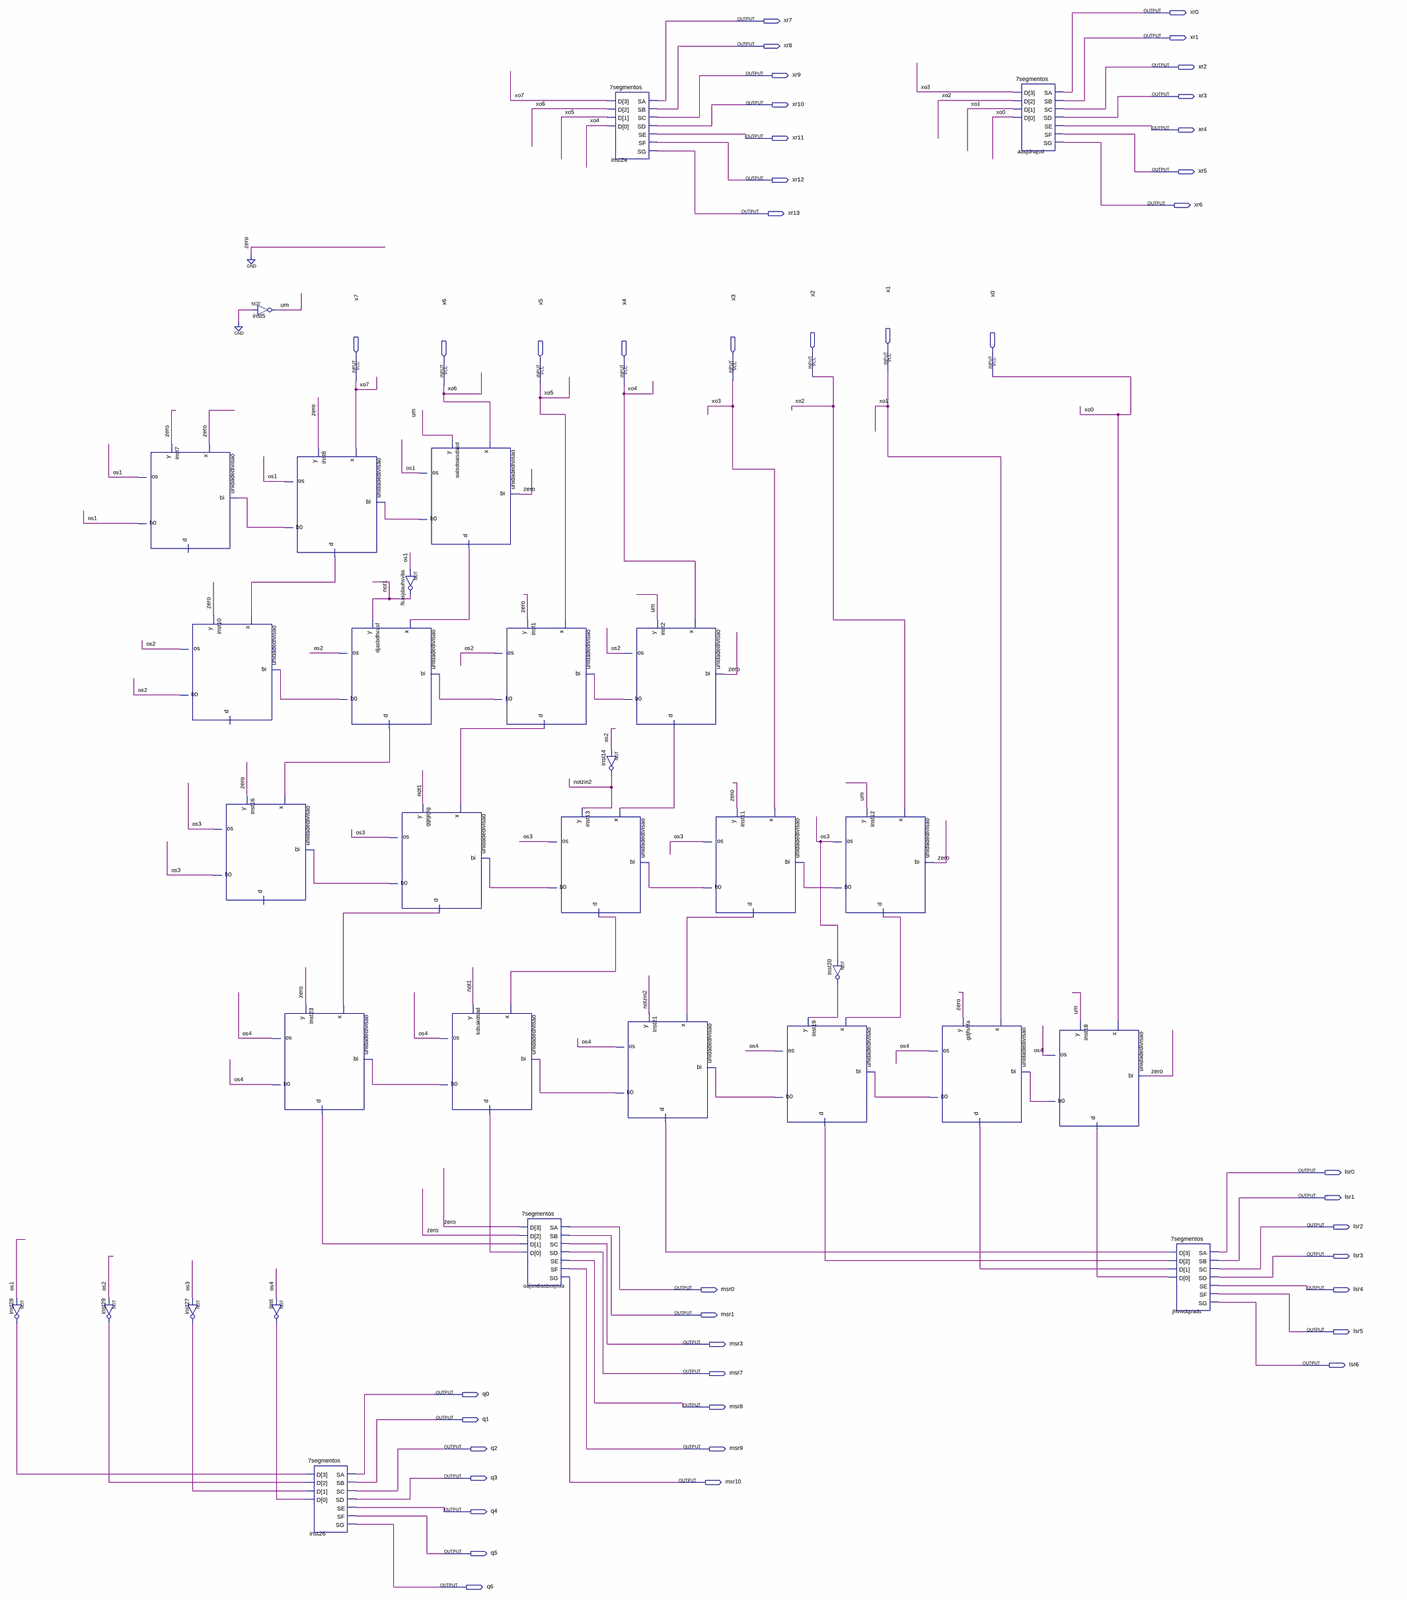
[diagram p0: schematic sheet, whole]
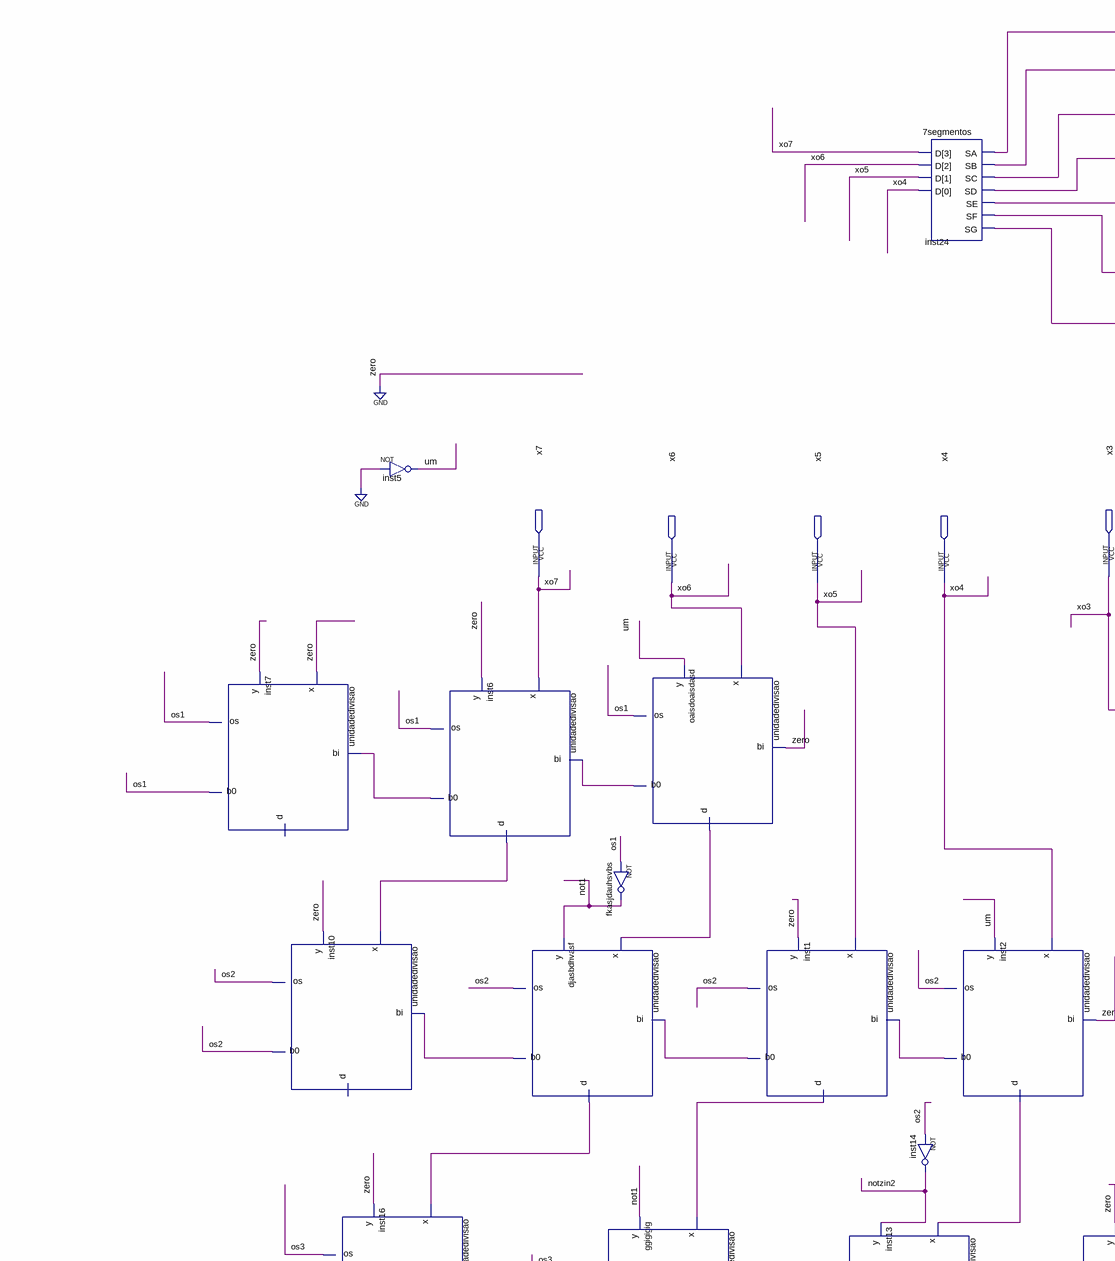
[diagram p1: schematic sheet, upper left part]
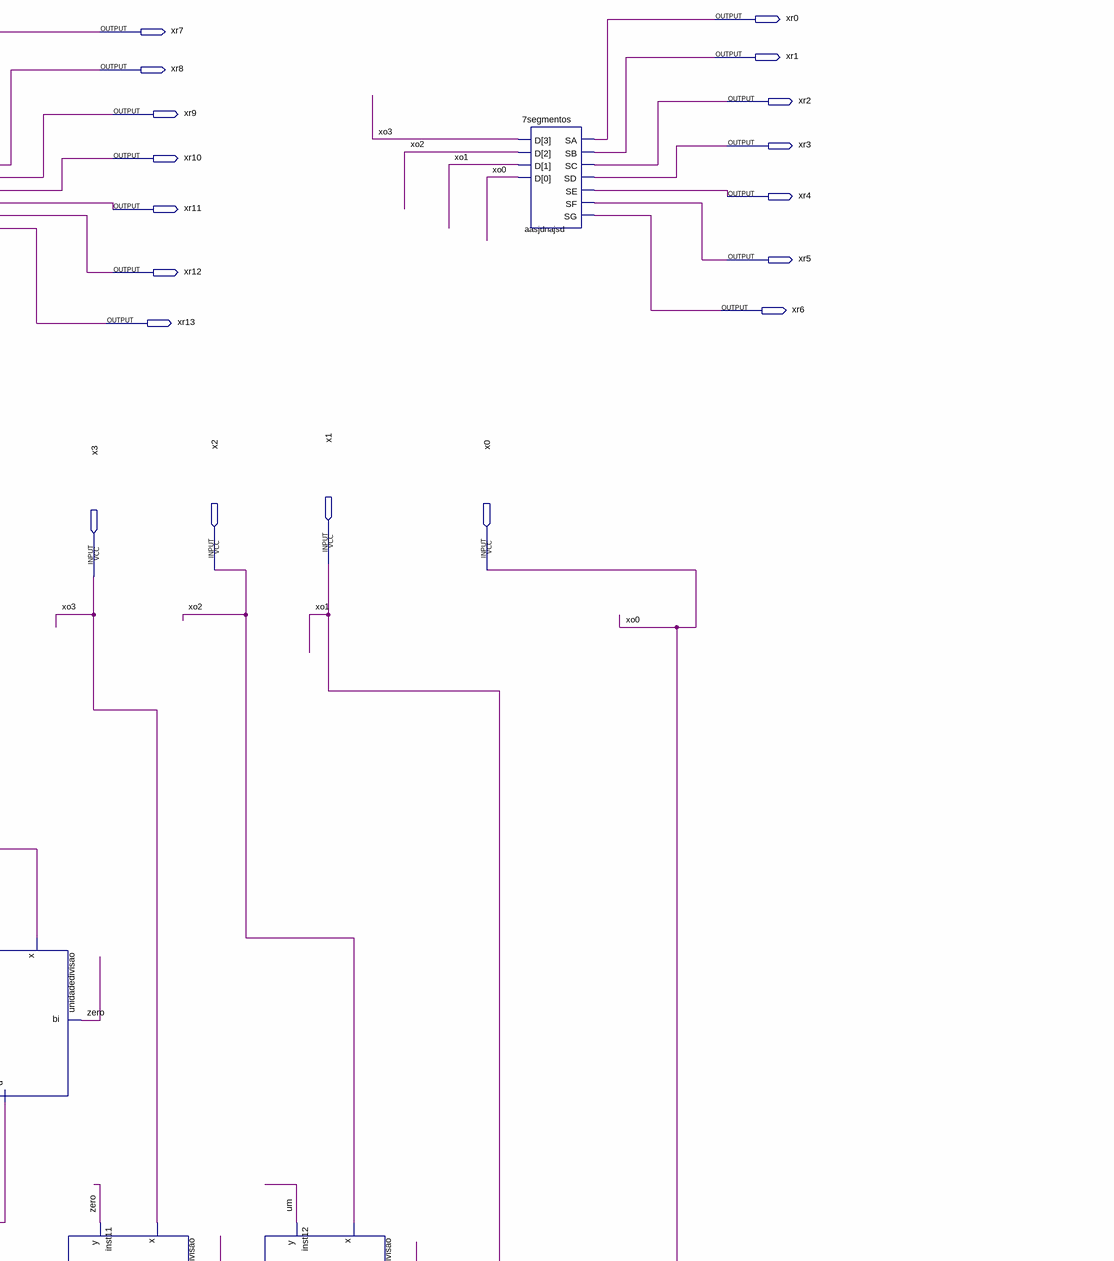
[diagram p2: schematic sheet, upper right part]
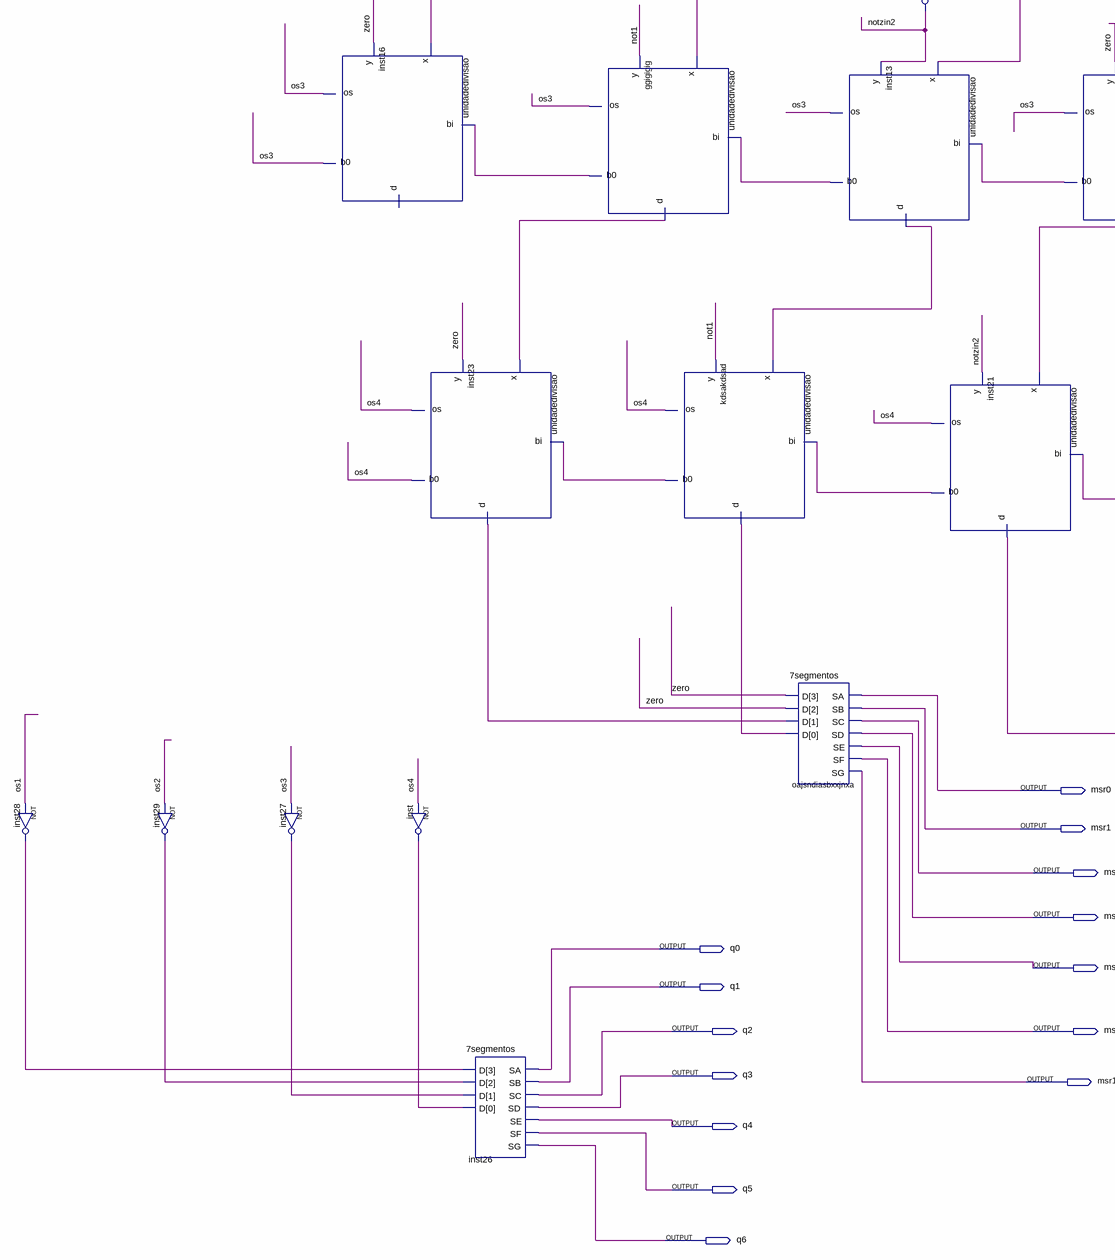
[diagram p3: schematic sheet, lower left part]
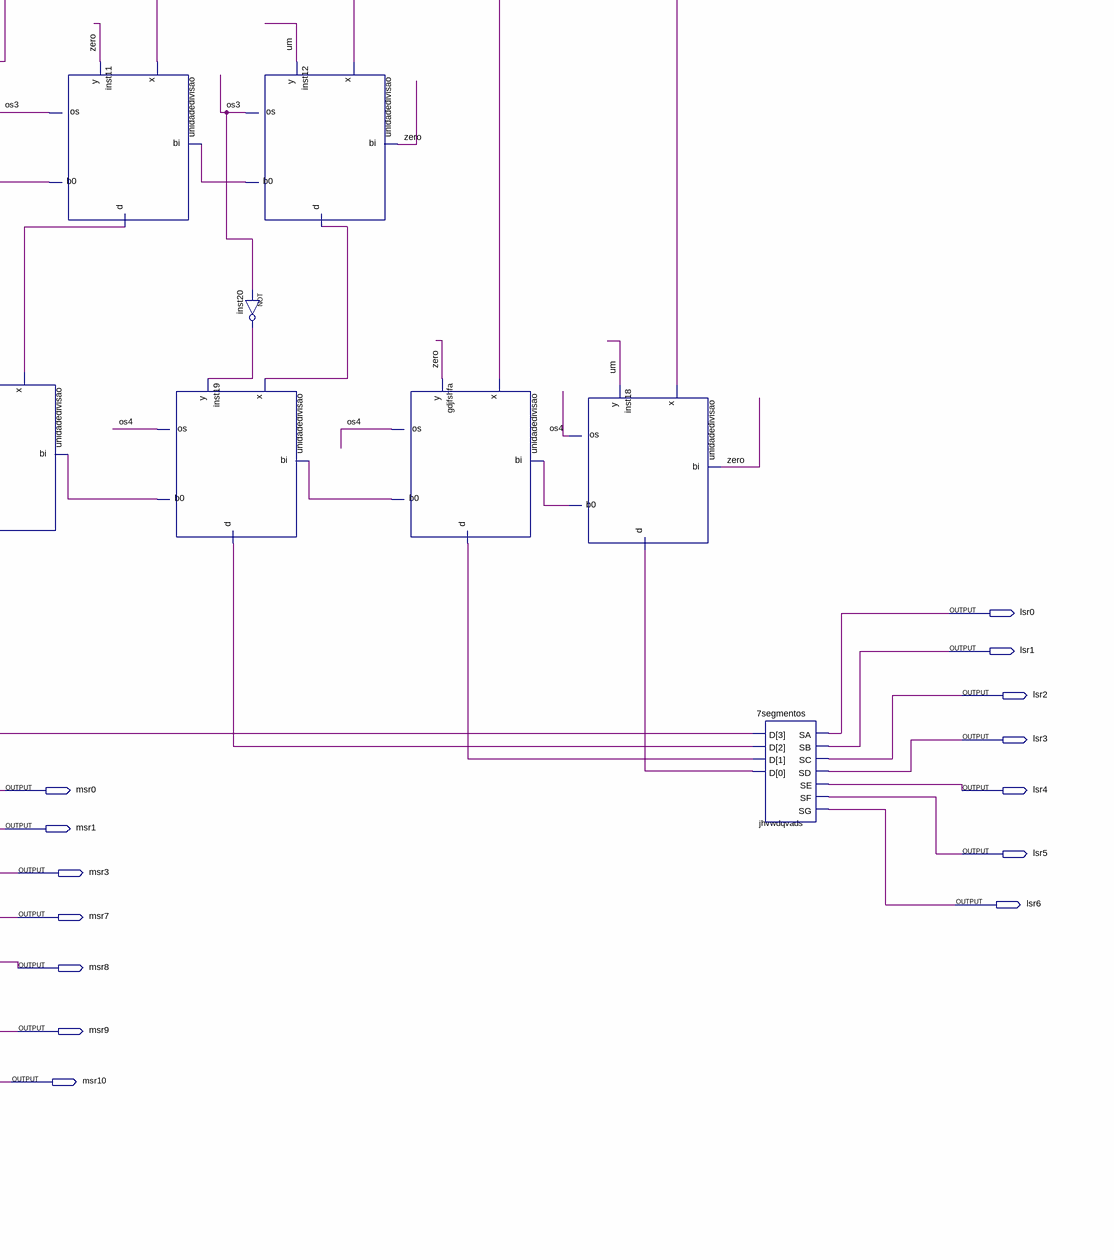
[diagram p4: schematic sheet, lower right part]
// Quartus schematic raiz.bdf as structural Verilog: 31 symbols, 43 pins
module raiz (
  input  x1,
  input  x2,
  input  x0,
  input  x7,
  input  x3,
  input  x6,
  input  x5,
  input  x4,
  output xr0,
  output xr7,
  output xr1,
  output xr8,
  output xr2,
  output xr9,
  output xr3,
  output xr10,
  output xr4,
  output xr11,
  output xr5,
  output xr12,
  output xr6,
  output xr13,
  output lsr0,
  output lsr1,
  output lsr2,
  output lsr3,
  output msr0,
  output lsr4,
  output msr1,
  output lsr5,
  output msr3,
  output lsr6,
  output msr7,
  output q0,
  output msr8,
  output q1,
  output q2,
  output msr9,
  output q3,
  output msr10,
  output q4,
  output q5,
  output q6
);

  wire djasbdhvasf_b0, djasbdhvasf_d, gdjfshfa_b0, gdjfshfa_d, ggigigig_b0, ggigigig_d, inst1_b0, inst1_d,
       inst2_b0, inst2_d, inst6_b0, inst6_d, inst11_b0, inst11_d, inst12_b0, inst12_d, inst13_b0, inst13_d,
       inst18_b0, inst18_d, inst19_b0, inst19_d, inst20_out, inst21_b0, inst21_d, inst23_d, inst27_out,
       inst28_out, inst29_out, inst_out, kdsakdsad_b0, kdsakdsad_d, not1, notzin2, oaisdoaisdasd_b0,
       oaisdoaisdasd_d, os1, os2, os3, os4, um;

  not inst28 (inst28_out, os1);
  not inst29 (inst29_out, os2);
  unidadedivisao inst7 (.os(os1), .bi(inst6_b0), .y(1'b0), .x(1'b0), .b0(os1));  // open: d
  unidadedivisao inst10 (.os(os2), .bi(djasbdhvasf_b0), .y(1'b0), .x(inst6_d), .b0(os2));  // open: d
  not inst27 (inst27_out, os3);
  unidadedivisao inst16 (.os(os3), .bi(ggigigig_b0), .y(1'b0), .x(djasbdhvasf_d), .b0(os3));  // open: d
  not inst5 (um, 1'b0);
  unidadedivisao inst6 (.os(os1), .bi(oaisdoaisdasd_b0), .y(1'b0), .x(x7), .b0(inst6_b0), .d(inst6_d));
  unidadedivisao inst23 (.os(os4), .bi(kdsakdsad_b0), .y(1'b0), .x(ggigigig_d), .b0(os4), .d(inst23_d));
  not inst (inst_out, os4);
  \7segmentos  inst26 (
    .D({inst28_out, inst29_out, inst27_out, inst_out}), .SA(q0), .SB(q1), .SC(q2), .SD(q3), .SE(q4), .SF(q5),
    .SG(q6));
  unidadedivisao djasbdhvasf (
    .os(os2), .bi(inst1_b0), .y(not1), .x(oaisdoaisdasd_d), .b0(djasbdhvasf_b0), .d(djasbdhvasf_d));
  unidadedivisao ggigigig (.os(os3), .bi(inst13_b0), .y(not1), .x(inst1_d), .b0(ggigigig_b0), .d(ggigigig_d));
  unidadedivisao oaisdoaisdasd (.os(os1), .bi(1'b0), .y(um), .x(x6), .b0(oaisdoaisdasd_b0), .d(oaisdoaisdasd_d));
  not fkasjdauhsvbs (not1, os1);
  unidadedivisao kdsakdsad (.os(os4), .bi(inst21_b0), .y(not1), .x(inst13_d), .b0(kdsakdsad_b0), .d(kdsakdsad_d));
  unidadedivisao inst1 (.os(os2), .bi(inst2_b0), .y(1'b0), .x(x5), .b0(inst1_b0), .d(inst1_d));
  \7segmentos  oajsndiasbxxjnxa (
    .D({2'b00, inst23_d, kdsakdsad_d}), .SA(msr0), .SB(msr1), .SC(msr3), .SD(msr7), .SE(msr8), .SF(msr9),
    .SG(msr10));
  unidadedivisao inst13 (.os(os3), .bi(inst11_b0), .y(notzin2), .x(inst2_d), .b0(inst13_b0), .d(inst13_d));
  \7segmentos  inst24 (.D({x7, x6, x5, x4}), .SA(xr7), .SB(xr8), .SC(xr9), .SD(xr10), .SE(xr11), .SF(xr12), .SG(xr13));
  unidadedivisao inst2 (.os(os2), .bi(1'b0), .y(um), .x(x4), .b0(inst2_b0), .d(inst2_d));
  not inst14 (notzin2, os2);
  unidadedivisao inst21 (.os(os4), .bi(inst19_b0), .y(notzin2), .x(inst11_d), .b0(inst21_b0), .d(inst21_d));
  unidadedivisao inst11 (.os(os3), .bi(inst12_b0), .y(1'b0), .x(x3), .b0(inst11_b0), .d(inst11_d));
  unidadedivisao inst19 (.os(os4), .bi(gdjfshfa_b0), .y(inst20_out), .x(inst12_d), .b0(inst19_b0), .d(inst19_d));
  not inst20 (inst20_out, os3);
  unidadedivisao inst12 (.os(os3), .bi(1'b0), .y(um), .x(x2), .b0(inst12_b0), .d(inst12_d));
  unidadedivisao gdjfshfa (.os(os4), .bi(inst18_b0), .y(1'b0), .x(x1), .b0(gdjfshfa_b0), .d(gdjfshfa_d));
  \7segmentos  aasjdnajsd (.D({x3, x2, x1, x0}), .SA(xr0), .SB(xr1), .SC(xr2), .SD(xr3), .SE(xr4), .SF(xr5), .SG(xr6));
  unidadedivisao inst18 (.os(os4), .bi(1'b0), .y(um), .x(x0), .b0(inst18_b0), .d(inst18_d));
  \7segmentos  jhvwdqvads (
    .D({inst21_d, inst19_d, gdjfshfa_d, inst18_d}), .SA(lsr0), .SB(lsr1), .SC(lsr2), .SD(lsr3), .SE(lsr4),
    .SF(lsr5), .SG(lsr6));

  // Other names for the same wires on the sheet: xo1 = x1; xo2 = x2; xo3 = x3; xo4 = x4; xo5 = x5; xo6 = x6; xo7 = x7;
  //   xo0 = x0
endmodule
